# EAGLE design CC3000_Breakout (EAGLE 6.1)
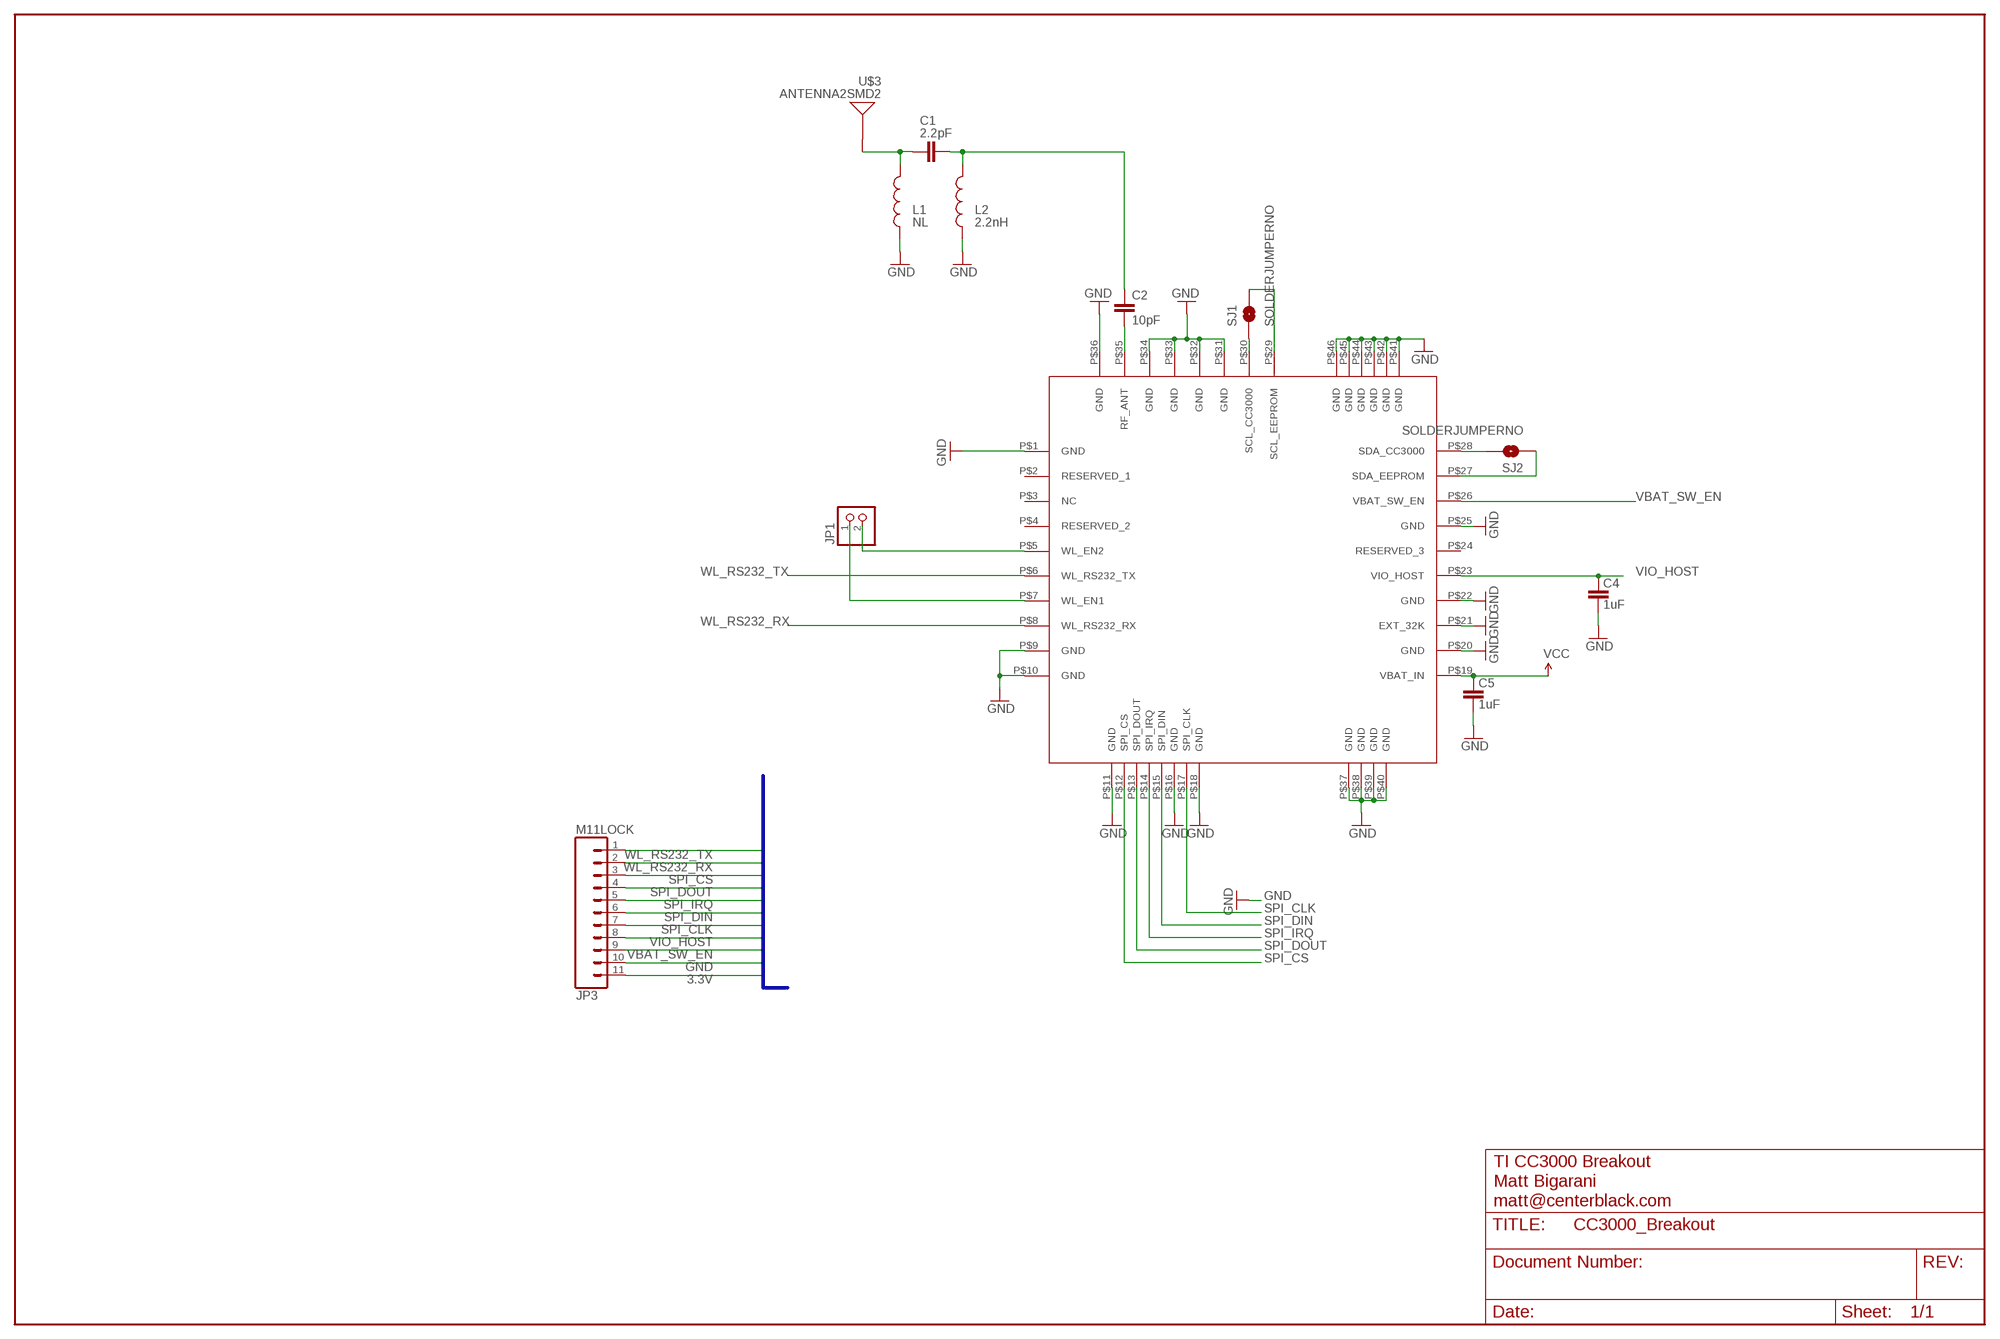
[diagram p0: schematic, sheet 1]

## Parts
C1  2.2pF  CAP0805  [0805]
C2  10pF  CAP0805  [0805]
C4  1uF  CAP0805  [0805]
C5  1uF  CAP0805  [0805]
JP1  PINHD-1X2  [1X02]
JP3  M11LOCK  [1X11_LOCK]
L1  NL  INDUCTOR0805  [0805]
L2  2.2nH  INDUCTOR0805  [0805]
SJ1  SOLDERJUMPERNO  [SJ_2S-NO]
SJ2  SOLDERJUMPERNO  [SJ_2S-NO]
U$1  CC3000  [CC3000]
U$3  ANTENNA2SMD2  [ANTENNA-CHIP3]

## Nets
3.3V: C5.2 JP3.11 U$1.P$19(VBAT_IN) ; supply symbol labelled VCC
GND: C4.1 C5.1 JP3.10 L1.1 L2.1 U$1.P$1(GND) U$1.P$9(GND) U$1.P$10(GND) U$1.P$11(GND) U$1.P$16(GND) U$1.P$18(GND) U$1.P$20(GND) U$1.P$21(EXT_32K) U$1.P$22(GND) U$1.P$25(GND) U$1.P$31(GND) U$1.P$32(GND) U$1.P$33(GND) U$1.P$34(GND) U$1.P$36(GND) U$1.P$37(GND) U$1.P$38(GND) U$1.P$39(GND) U$1.P$40(GND) U$1.P$41(GND) U$1.P$42(GND) U$1.P$43(GND) U$1.P$44(GND) U$1.P$45(GND) U$1.P$46(GND)
N$10: C1.2 C2.1 L2.2
N$13: C2.2 U$1.P$35(RF_ANT)
N$14: SJ1.1 U$1.P$30(SCL_CC3000)
N$15: C1.1 L1.2 U$3.FEED(SIGNAL)
N$16: SJ1.2 U$1.P$29(SCL_EEPROM)
N$17: SJ2.2 U$1.P$28(SDA_CC3000)
N$18: SJ2.1 U$1.P$27(SDA_EEPROM)
SPI_CLK: JP3.7 U$1.P$17(SPI_CLK)
SPI_CS: JP3.3 U$1.P$12(SPI_CS)
SPI_DIN: JP3.6 U$1.P$15(SPI_DIN)
SPI_DOUT: JP3.4 U$1.P$13(SPI_DOUT)
SPI_IRQ: JP3.5 U$1.P$14(SPI_IRQ)
VBAT_SW_EN: JP3.9 U$1.P$26(VBAT_SW_EN)
VIO_HOST: C4.2 JP3.8 U$1.P$23(VIO_HOST)
WL_EN1: JP1.1 U$1.P$7(WL_EN1)
WL_EN2: JP1.2 U$1.P$5(WL_EN2)
WL_RS232_RX: JP3.2 U$1.P$8(WL_RS232_RX)
WL_RS232_TX: JP3.1 U$1.P$6(WL_RS232_TX)
Unconnected: U$1.P$2(RESERVED_1) U$1.P$3(NC) U$1.P$4(RESERVED_2) U$1.P$24(RESERVED_3)

## Buses
VBAT_SW_EN,VIO_HOST,SPI_CLK,SPI_DIN,SPI_IRQ,SPI_DOUT,SPI_CS,WL_RS232_RX,WL_RS232_TX,GND,VCC

## Notes on the sheet
- TI CC3000 Breakout
- Matt Bigarani
- matt@centerblack.com

## Library data of the parts
C1 C2 C4 C5 = SparkFun:CAP: Capacitor Standard 0603 ceramic capacitor, and 0.1" leaded capacitor.
JP1 = pinhead:PINHD-1X2: PIN HEADER
JP3 = SparkFun:M11: Header 11 Standard 11-pin 0.1" header. Use with straight break away headers (SKU : PRT-00116), right angle break away headers (PRT-00553), swiss pins (PRT-00743), machine pins (PRT-00117), and female headers (PRT-00115).
L1 L2 = SparkFun:INDUCTOR: Inductors Basic Inductor/Choke - 0603 and 1206. Footprints are not proven and vary greatly between part numbers.
SJ1 SJ2 = SparkFun:SOLDERJUMPER: Solder Jumper Standard SMD solder jumper. Used to automate production. Two varients : Normally Open and Normally Closed are the same, but have different paste layers. NC will have a large amount of paste and should jumper during reflow.
U$1 = centerblack_engineering:CC3000: TI SimpleLink CC3000 Module - WiFi 802.11b/g Network Processor; AUTHOR: Matt Bigarani; DATASHEET: http://www.ti.com/lit/ds/symlink/cc3000.pdf; DATE: 2/8/2013
U$3 = SparkFun:ANTENNA2: Antenna Single endded antenna. Common with smaller chip antennas. CHIP4 package is the GPS Chip Antenna SKU: GPS-08418. CHIP5 package is 2.4GHz chip antenna SKU: WRL-00144.

## Board
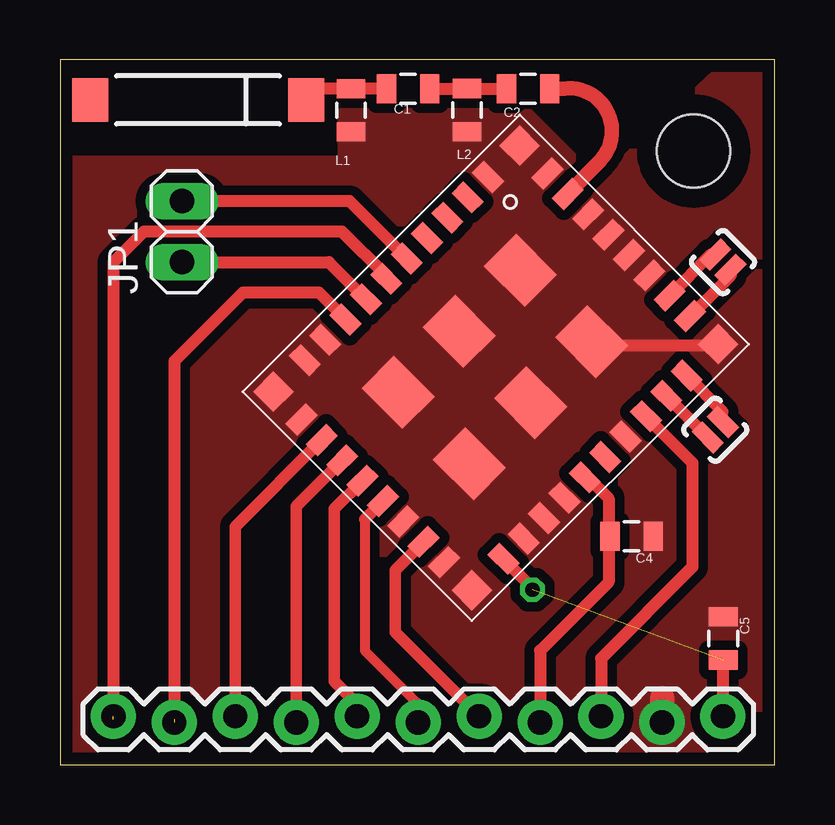
[diagram p1: board, top side]
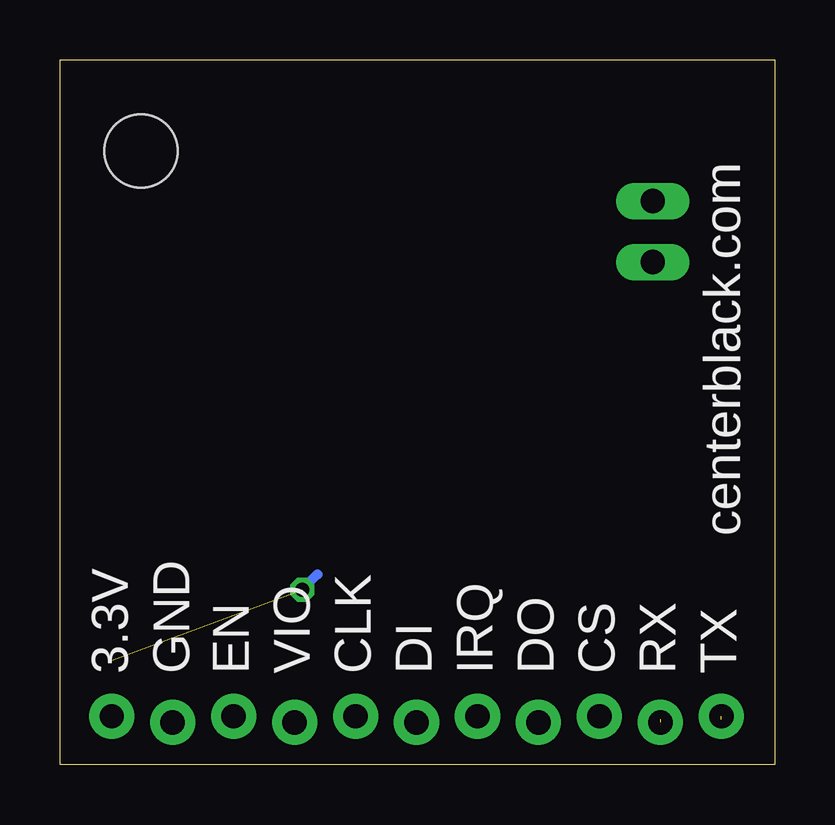
[diagram p2: board, bottom side, seen from below]

Size 29.78 x 29.38 mm. Coordinates in mm from the lower left corner, seen from the top.
Outline: 0,0 29.78,0 29.78,29.37 0,29.37 0,0
Copper layers (1*16): Top 0.035mm / dielectric 1.5mm / Bottom 0.035mm
Design rules: minimum track width 10mil, minimum drill 24mil, track to track 8mil, track to pad 8mil, pad to pad 8mil, via to via 8mil, smd to smd 8mil, copper to edge 20mil, drill to drill 8mil, minimum pad ring 10mil, minimum via ring 8mil, stop-mask expansion 4mil, vias tented up to drill 0mil, thermal gap 10mil

### Footprints (pad centres in the part's own frame; a part is rotated, then mirrored left to right if it is on the bottom)
0805 = smd 0.8 x 1.2: 1 -0.9,0; 2 0.9,0
1X02 = drill 1.016 long: 1 -1.27,0; 2 1.27,0
1X11_LOCK = drill 1.016 pad 1.88: 1 0,0.127; 2 2.54,-0.127; 3 5.08,0.127; 4 7.62,-0.127; 5 10.16,0.127; 6 12.7,-0.127; 7 15.24,0.127; 8 17.78,-0.127; 9 20.32,0.127; 10 22.86,-0.127; 11 25.4,0.127
SJ_2S-NO = smd 0.635 x 1.27: 1 -0.45,0; 2 0.45,0
CC3000 = smd 1.2 x 0.7: P$1 0.9,13.55; P$2 0.9,12.35; P$3 0.9,11.15; P$4 0.9,9.95; P$5 0.9,8.75; P$6 0.9,7.55; P$7 0.9,6.35; P$8 0.9,5.15; P$9 0.9,3.95; P$10 0.9,2.75; P$19 12.6,2.75; P$20 12.6,3.95; P$21 12.6,5.15; P$22 12.6,6.35; P$23 12.6,7.55; P$24 12.6,8.75; P$25 12.6,9.95; P$26 12.6,11.15; P$27 12.6,12.35; P$28 12.6,13.55 | smd 0.7 x 1.2: P$11 2.55,0.9; P$12 3.75,0.9; P$13 4.95,0.9; P$14 6.15,0.9; P$15 7.35,0.9; P$16 8.55,0.9; P$17 9.75,0.9; P$18 10.95,0.9; P$29 10.95,15.4; P$30 9.75,15.4; P$31 8.55,15.4; P$32 7.35,15.4; P$33 6.15,15.4; P$34 4.95,15.4; P$35 3.75,15.4; P$36 2.55,15.4 | smd 2.4 x 1.9: P$37 4.6,11.75; P$38 4.6,8.15; P$39 4.6,4.55; P$40 8.8,11.75; P$41 8.8,8.15; P$42 8.8,4.55 | smd 1.2 x 1.2: P$43 0.9,15.4; P$44 0.9,0.9; P$45 12.6,0.9; P$46 12.6,15.4
STAND-OFF-TIGHT = hole 3.048: 0,0
ANTENNA-CHIP3 = smd 1.8 x 1.5: FEED 0,4.5; NC 0,-4.5

### Placement (x,y rotation side)
C1  14.5,28.18 0 top
C2  19.5,28.18 0 top
C4  23.81,9.52 180 top
C5  27.63,5.27 270 top
JP1  5.08,22.23 90 top
JP3  2.22,1.91 0 top
L1  12.12,27.28 90 top
L2  16.96,27.28 90 top
SJ1  27.62,20.96 315 top
SJ2  27.3,13.97 45 top
U$1  7.62,15.56 315 top
U$2  [STAND-OFF-TIGHT]  26.4,25.58 0 top
U$3  5.75,27.71 270 top

### Tracks (layer width: path | path; a pad name or v marks a point on that pad's centre or on a via)
3.3V  (via drill 0.6)  (1 unrouted)
  Top 0.406: 19.68,7.38 v19.68,7.3
  Top 0.483: U$1.P$19 19.68,7.38
  Top 0.508: C5.2 JP3.11 27.62,1.91
  Bottom 0.406: v19.68,7.3 19.05,7.94
GND
  Top 0.508: U$1.P$46 27.34,17.46 22.54,17.46 22.36,17.64 U$1.P$40
  Top 1.016: 25.1,2.78 25.1,1.78
  pour Top (isolate 0.406, no thermals): 0,-0.32 30,-0.32 30,29.43 28,29.43 24,25.68 21.25,22.93 20.75,22.93 20.25,23.43 20.25,23.93 21.5,25.18 19.5,27.18 11.75,27.18 11.75,25.18 0,25.18
N$10
  Top 0.508: C1.2 L2.2 C2.1
N$13
  Top 0.6: U$1.P$35 22.5,25.18 arc141 21,28.18 C2.2
N$14
  Top 0.483: 27.12,21.27 U$1.P$30
  Top 0.508: SJ1.1 27.12,21.27
N$15
  Top 0.508: C1.1 | C1.1 L1.2 10.72,28.18 U$3.FEED
N$16
  Top 0.483: 27.94,20.39 U$1.P$29
  Top 0.508: SJ1.2 27.94,20.39
N$17
  Top 0.406: 27.62,14.72 SJ2.2
  Top 0.483: U$1.P$28 27.62,14.72
N$18
  Top 0.406: SJ2.1
  Top 0.483: U$1.P$27 SJ2.1
SPI_CLK
  Top 0.483: U$1.P$17 13.97,8.12 13.97,5.52 JP3.7
SPI_CS
  Top 0.483: U$1.P$12 7.3,9.94 JP3.3
SPI_DIN
  Top 0.406: 12.7,10.24 12.7,4.76 14.92,2.54
  Top 0.483: U$1.P$15 12.7,10.24 | JP3.6 14.92,2.54
SPI_DOUT
  Top 0.483: U$1.P$13 9.84,10.78 JP3.4
SPI_IRQ
  Top 0.483: U$1.P$14 11.43,10.67 11.43,3.49 12.38,2.54 JP3.5
VBAT_SW_EN
  Top 0.508: U$1.P$26 26.35,12.59 26.35,8.25 22.54,4.45 JP3.9
VIO_HOST
  Top 0.508: U$1.P$23 21.99,11.99 22.86,11.11 22.86,9.52 | 22.86,9.52 22.86,7.62 20,4.76 JP3.8 | C4.2 22.86,9.52
WL_EN1
  Top 0.508: JP1.1 11.2,20.96 U$1.P$7
WL_EN2
  Top 0.483: U$1.P$5 12.36,23.19
  Top 0.508: U$1.P$5 12.06,23.49 JP1.2
WL_RS232_RX  (1 unrouted)
  Top 0.508: U$1.P$8 11.9,18.58 10.79,19.69 7.62,19.69 4.76,16.83 4.76,1.91
WL_RS232_TX  (1 unrouted)
  Top 0.508: U$1.P$6 13.6,20.38 11.75,22.23 3.49,22.23 2.22,20.96 2.22,1.91

### Text on the board
bPlace: centerblack.com | TX | RX | CS | DO | IRQ | DI | CLK | VIO | EN | GND | 3.3V